# EAGLE design espDash (EAGLE 7.6.0)
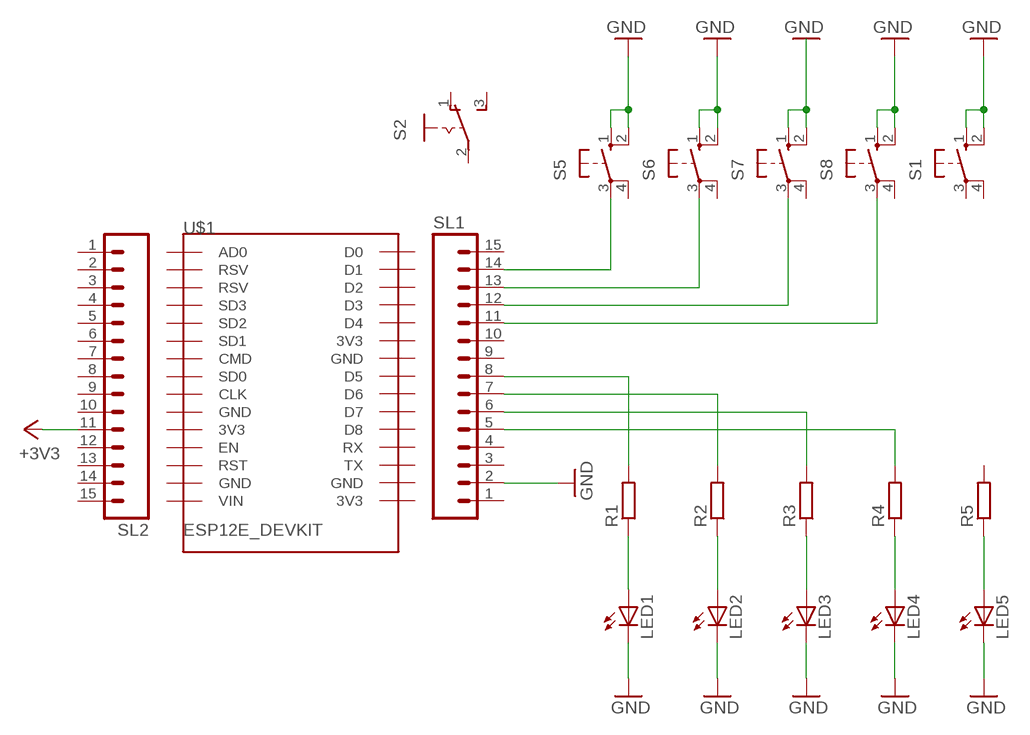
[diagram p0: schematic, sheet 1]

## Parts
LED1  LED5MM  [LED5MM]
LED2  LED5MM  [LED5MM]
LED3  LED5MM  [LED5MM]
LED4  LED5MM  [LED5MM]
LED5  LED5MM  [LED5MM]
R1  R-EU_0207/10  [0207/10]
R2  R-EU_0207/10  [0207/10]
R3  R-EU_0207/10  [0207/10]
R4  R-EU_0207/10  [0207/10]
R5  R-EU_0207/10  [0207/10]
S1  40-XX  [B3F-40XX]
S2  M251  [M251]
S5  40-XX  [B3F-40XX]
S6  40-XX  [B3F-40XX]
S7  40-XX  [B3F-40XX]
S8  40-XX  [B3F-40XX]
SL1  M15  [15P]
SL2  M15  [15P]
U$1  ESP12E_DEVKIT  [ESP12E_DEVKIT]

## Nets
+3V3: SL2.11
GND: LED1.K(C) LED2.K(C) LED3.K(C) LED4.K(C) LED5.K(C) S1.1(S) S1.2(S1) S5.1(S) S5.2(S1) S6.1(S) S6.2(S1) S8.1(S) S8.2(S1) SL1.2
N$1: S5.3(P) SL1.14
N$2: S6.3(P) SL1.13
N$3: S7.3(P) SL1.12
N$4: S8.3(P) SL1.11
N$5: R1.2 SL1.8
N$6: R2.2 SL1.7
N$7: R3.2 SL1.6
N$8: R4.2 SL1.5
N$9: LED3.A R3.1
N$10: LED4.A R4.1
N$11: S7.1(S) S7.2(S1)
N$12: LED1.A R1.1
N$14: LED5.A R5.1
N$15: LED2.A R2.1
Unconnected: R5.2 S1.3(P) S1.4(P1) S2.1(O) S2.2(P) S2.3(S) S5.4(P1) S6.4(P1) S7.4(P1) S8.4(P1) SL1.1 SL1.3 SL1.4 SL1.9 SL1.10 SL1.15 SL2.1 SL2.2 SL2.3 SL2.4 SL2.5 SL2.6 SL2.7 SL2.8 SL2.9 SL2.10 SL2.12 SL2.13 SL2.14 SL2.15 U$1.3V3@0(3V3) U$1.3V3@1(3V3) U$1.3V3@2(3V3) U$1.AD0 U$1.CLK U$1.CMD U$1.D0 U$1.D1 U$1.D2 U$1.D3 U$1.D4 U$1.D5 U$1.D6 U$1.D7 U$1.D8 U$1.EN U$1.GND@0(GND) U$1.GND@1(GND) U$1.GND@2(GND) U$1.GND@3(GND) U$1.RST U$1.RSV@0(RSV) U$1.RSV@1(RSV) U$1.RX U$1.SD0 U$1.SD1 U$1.SD2 U$1.SD3 U$1.TX U$1.VIN

## Library data of the parts
LED1-LED5 = led:LED: LED OSRAM: - CHIPLED LG R971, LG N971, LY N971, LG Q971, LY Q971, LO R971, LY R971 LH N974, LH R974 LS Q976, LO Q976, LY Q976 LO Q996 - Hyper CHIPLED LW Q18S LB Q993, LB Q99A, LB R99A - SideLED LS A670, LO A670, LY A670, LG A670, LP A670 LB A673, LV A673, LT A673, LW A673 LH A674 LY A675 LS A676, LA A676, LO A676, LY A676, LW A676 LS A679, LY A679, LG A679 - Hyper Micro SIDELED® LS Y876, LA Y876, LO Y876, LY Y876 LT Y87S - SmartLED LW L88C, LW L88S LB L89C, LB L89S, LG L890 LS L89K, LO L89K, LY L89K LS L896, LA L896, LO L896, LY L896 - TOPLED LS T670, LO T670, LY T670, LG T670, LP T670 LSG T670, LSP T670, LSY T670, LOP T670, LYG T670 LG T671, LOG T671, LSG T671 LB T673, LV T673, LT T673, LW T673 LH T674 LS T676, LA T676, LO T676, LY T676, LB T676, LH T676, LSB T676, LW T676 LB T67C, LV T67C, LT T67C, LS T67K, LO T67K, LY T67K, LW E67C LS E67B, LA E67B, LO E67B, LY E67B, LB E67C, LV E67C, LT E67C LW T67C LS T679, LY T679, LG T679 LS T770, LO T770, LY T770, LG T770, LP T770 LB T773, LV T773, LT T773, LW T773 LH T774 LS E675, LA E675, LY E675, LS T675 LS T776, LA T776, LO T776, LY T776, LB T776 LHGB T686 LT T68C, LB T68C - Hyper Mini TOPLED® LB M676 - Mini TOPLED Santana® LG M470 LS M47K, LO M47K, LY M47K Source: http://www.osram.convergy.de LUXEON: - LUMILED® LXK2-PW12-R00, LXK2-PW12-S00, LXK2-PW14-U00, LXK2-PW14-V00 LXK2-PM12-R00, LXK2-PM12-S00, LXK2-PM14-U00 LXK2-PE12-Q00, LXK2-PE12-R00, LXK2-PE12-S00, LXK2-PE14-T00, LXK2-PE14-U00 LXK2-PB12-K00, LXK2-PB12-L00, LXK2-PB12-M00, LXK2-PB14-N00, LXK2-PB14-P00, LXK2-PB14-Q00 LXK2-PR12-L00, LXK2-PR12-M00, LXK2-PR14-Q00, LXK2-PR14-R00 LXK2-PD12-Q00, LXK2-PD12-R00, LXK2-PD12-S00 LXK2-PH12-R00, LXK2-PH12-S00 LXK2-PL12-P00, LXK2-PL12-Q00, LXK2-PL12-R00 Source: www.luxeon.com KINGBRIGHT: KA-3528ASYC Source: www.kingbright.com
R1-R5 = rcl:R-EU_: RESISTOR, European symbol
S1 S5-S8 = switch-omron:40-XX: OMRON SWITCH; MF: OMRON COMPONENTS USA; MPN: B3F-4000; OC_FARNELL: 176434; OC_NEWARK: 36K3105
S2 = switch:M251: SLIDING SWITCH Mors, distributor Buerklin, 11G702
SL1 SL2 = con-amp-quick:M15: AMP QUICK CONNECTOR; OC_FARNELL: unknown; OC_NEWARK: unknown
U$1 = nodemcuLatest:ESP12E_DEVKIT: ESP12E DEVKIT BOARD

## Board
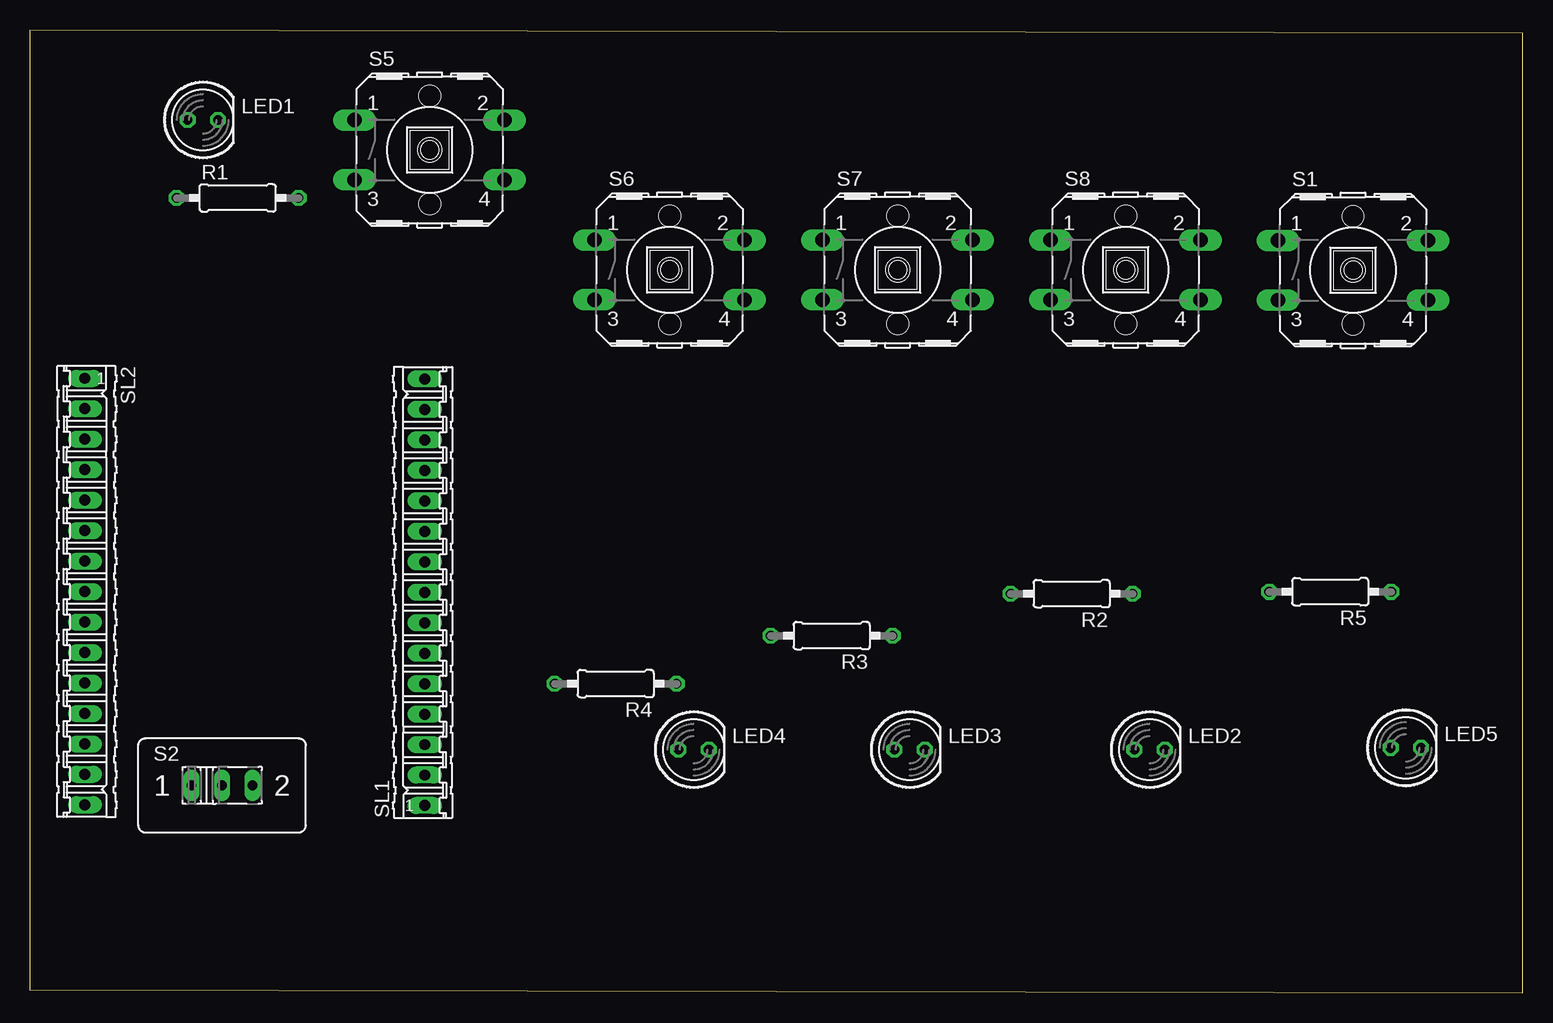
[diagram p1: board, top side]
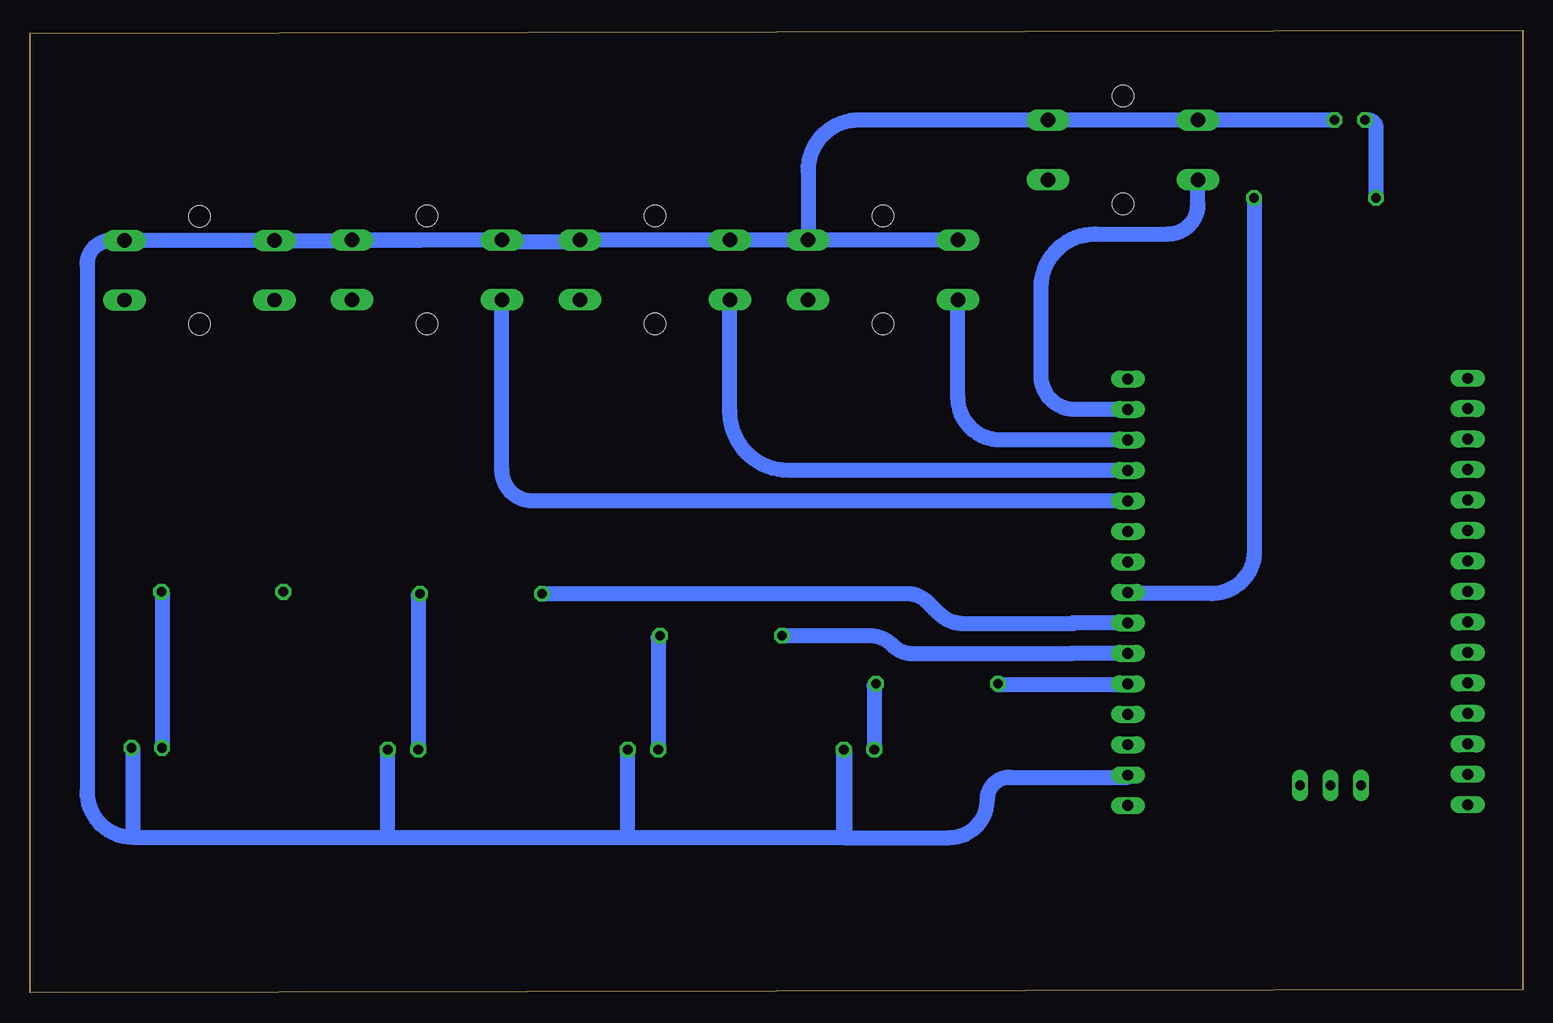
[diagram p2: board, bottom side, seen from below]

Size 124.38 x 80.25 mm. Coordinates in mm from the lower left corner, seen from the top.
Outline: 0,0.25 124.38,0 124.38,80 0,80.25 0,0.25
Copper layers (1*16): Top 0.035mm / dielectric 1.5mm / Bottom 0.035mm
Design rules "default": minimum track width 10mil, minimum drill 24mil, track to track 8mil, track to pad 8mil, pad to pad 8mil, via to via 8mil, smd to smd 8mil, copper to edge 40mil, drill to drill 8mil, minimum pad ring 10mil, minimum via ring 8mil, stop-mask expansion 4mil, vias tented up to drill 0mil, thermal gap 10mil

### Footprints (pad centres in the part's own frame; a part is rotated, then mirrored left to right if it is on the bottom)
LED5MM = drill 0.813 octagon: A -1.27,0; K 1.27,0
0207/10 = drill 0.813 octagon: 1 -5.08,0; 2 5.08,0
B3F-40XX = drill 1.194 long: 1 -6.248,2.489; 2 6.248,2.489; 3 -6.248,-2.489; 4 6.248,-2.489 | hole 1.803: 0,-4.496; 0,4.496
M251 = drill 0.813 long: 1 -2.54,0; 2 0,0; 3 2.54,0
15P = drill 0.914 long: 1 -17.78,0; 2 -15.24,0; 3 -12.7,0; 4 -10.16,0; 5 -7.62,0; 6 -5.08,0; 7 -2.54,0; 8 0,0; 9 2.54,0; 10 5.08,0; 11 7.62,0; 12 10.16,0; 13 12.7,0; 14 15.24,0; 15 17.78,0
ESP12E_DEVKIT = drill 0.8 pad 1.93: 3V3@0 -14.13,-7.62; 3V3@1 14.13,5.08; 3V3@2 14.13,-17.78; AD0 -14.13,17.78; CLK -14.13,-2.54; CMD -14.13,2.54; D0 14.13,17.78; D1 14.13,15.24; D2 14.13,12.7; D3 14.13,10.16; D4 14.13,7.62; D5 14.13,0; D6 14.13,-2.54; D7 14.13,-5.08; D8 14.13,-7.62; EN -14.13,-10.16; GND@0 -14.13,-5.08; GND@1 -14.13,-15.24; GND@2 14.13,2.54; GND@3 14.13,-15.24; RST -14.13,-12.7; RSV@0 -14.13,15.24; RSV@1 -14.13,12.7; RX 14.13,-10.16; SD0 -14.13,0; SD1 -14.13,5.08; SD2 -14.13,7.62; SD3 -14.13,10.16; TX 14.13,-12.7; VIN -14.13,-17.78 | hole 3.2: -12.86,26.34; 12.86,26.34; 12.86,-26.34; -12.86,-26.34

### Placement (x,y rotation side)
LED1  14.4,72.75 0 top
LED2  93.3,20.25 0 top
LED3  73.3,20.25 0 top
LED4  55.3,20.25 0 top
LED5  114.65,20.41 0 top
R1  17.3,66.25 0 top
R2  86.8,33.25 180 top
R3  66.8,29.75 180 top
R4  48.8,25.75 180 top
R5  108.35,33.41 180 top
S1  110.25,60.22 0 top
S2  16,17.27 0 top
S5  33.3,70.25 0 top
S6  53.3,60.25 0 top
S7  72.3,60.25 0 top
S8  91.3,60.25 0 top
SL1  32.89,33.37 90 top
SL2  4.57,33.43 270 top
U$1  54.54,-33.8 0 top  (outside the outline)

### Tracks (layer width: path | path; a pad name or v marks a point on that pad's centre or on a via)
GND  (via drill 0.6)
  Bottom 1.27: LED1.K v27.05,72.75 S5.1 S5.2 55.31,72.74 arc-90 59.55,68.5 S6.2 | S6.1 S6.2 | S6.2 78.8,62.74 78.8,62.55 85.05,62.55 S8.1 S8.2 | S8.2 91.7,62.74 | LED2.K 94.6,20.25 94.6,12.95 | 94.6,12.95 74.6,12.95 | 74.6,12.95 74.57,12.95 | 74.57,12.95 LED3.K 74.6,20.25 74.6,12.95 | 74.57,12.95 56.57,12.95 LED4.K 56.49,20.25 56.49,12.91 47.81,12.91 arc-90 44.6,16.12 arc90 42.77,17.95 32.89,17.95 SL1.2 | S8.2 97.55,62.71 S1.1 S1.2 117.6,62.71 arc-90 119.63,60.68 119.63,16.76 arc-90 115.82,12.95 | LED5.K 115.82,20.41 115.82,12.95 | 115.82,12.95 94.6,12.95
N$1
  Bottom 1.27: SL1.14 37.31,48.61 arc90 40.13,51.43 40.13,58.75 arc90 35.64,63.25 29.52,63.25 arc-90 27.05,65.71 S5.3
N$2
  Bottom 1.27: SL1.13 43.52,46.07 arc90 47.05,49.61 S6.3
N$3
  Bottom 1.27: SL1.12 61.16,43.53 arc90 66.05,48.42 S7.3
N$4
  Bottom 1.27: SL1.11 82.52,40.99 arc90 85.05,43.53 S8.3
N$5
  Bottom 1.27: R1.2 22.35,66.25 22.35,36.8 arc90 25.88,33.27 32.89,33.27 SL1.8
N$6
  Bottom 1.27: R2.2 51.29,33.25 arc45 49.6,32.55 48.69,31.64 arc-45 46.54,30.75 37.47,30.75 37.47,30.83 SL1.7
N$7
  Bottom 1.27: R3.2 54.46,29.75 arc45 52.48,28.93 52.45,28.9 arc-45 50.89,28.25 37.51,28.25 37.51,28.29 SL1.6
N$8
  Bottom 1.27: R4.2 43.72,25.67 32.89,25.67 SL1.5
N$9
  Bottom 1.27: R3.1 72.03,29.6 LED3.A
N$10
  Bottom 1.27: R4.1 54.03,25.6 LED4.A
N$11
  Bottom 1.27: S7.1 S7.2
N$12
  Bottom 1.27: LED1.A 12.88,72.75 arc90 12.22,72.1 R1.1
N$14
  Bottom 1.27: R5.1 113.38,33.41 LED5.A
N$15
  Bottom 1.27: R2.1 92.03,33.1 LED2.A